# Altium project Calc_Project.PrjPcb
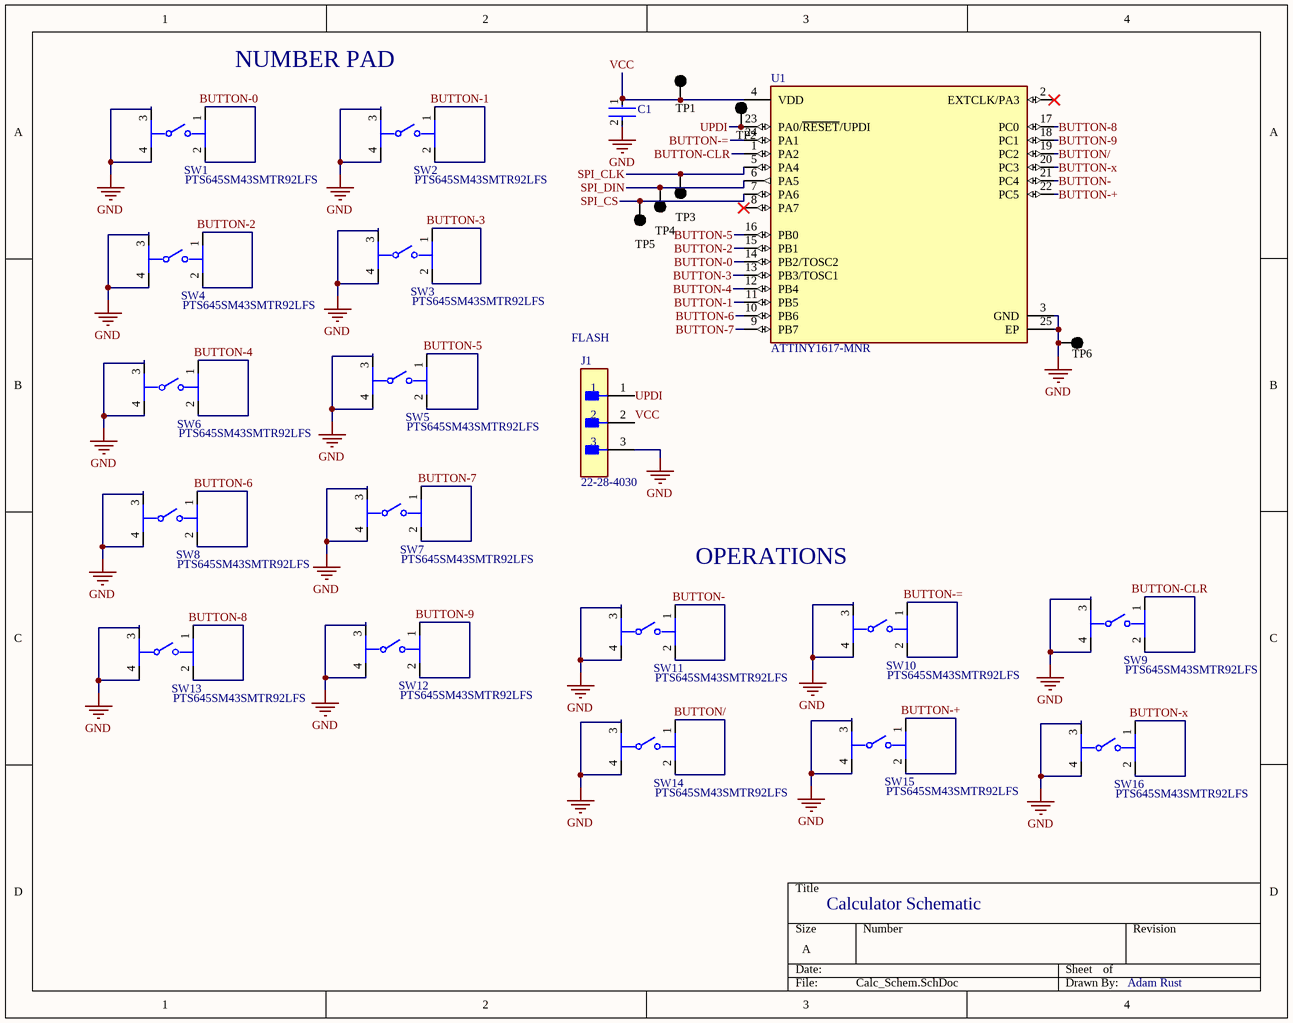
[diagram p0: Calc_Schem.SchDoc]
2 sheets, 35 parts. Net scope: global (net labels, ports and power ports of the same name join across sheets).
Board file: CalcPCB_Project.PcbDoc
Sheets:
  Calc_Schem.SchDoc
  MAX_7SEG_USBC.SchDoc

## Sheet Calc_Schem.SchDoc
size A; SheetNumber: 1; SheetTotal: 2

### Parts
C1  GRM155R71C104KA88D  [FP-GRM15-MFG]  (value not drawn)
J1  22-28-4030  [FP-22-28-4030-MFG]
SW1  PTS645SM43SMTR92LFS  [FP-PTS645SM43SMTR92LFS-MFG]
SW2  PTS645SM43SMTR92LFS  [FP-PTS645SM43SMTR92LFS-MFG]
SW3  PTS645SM43SMTR92LFS  [FP-PTS645SM43SMTR92LFS-MFG]
SW4  PTS645SM43SMTR92LFS  [FP-PTS645SM43SMTR92LFS-MFG]
SW5  PTS645SM43SMTR92LFS  [FP-PTS645SM43SMTR92LFS-MFG]
SW6  PTS645SM43SMTR92LFS  [FP-PTS645SM43SMTR92LFS-MFG]
SW7  PTS645SM43SMTR92LFS  [FP-PTS645SM43SMTR92LFS-MFG]
SW8  PTS645SM43SMTR92LFS  [FP-PTS645SM43SMTR92LFS-MFG]
SW9  PTS645SM43SMTR92LFS  [FP-PTS645SM43SMTR92LFS-MFG]
SW10  PTS645SM43SMTR92LFS  [FP-PTS645SM43SMTR92LFS-MFG]
SW11  PTS645SM43SMTR92LFS  [FP-PTS645SM43SMTR92LFS-MFG]
SW12  PTS645SM43SMTR92LFS  [FP-PTS645SM43SMTR92LFS-MFG]
SW13  PTS645SM43SMTR92LFS  [FP-PTS645SM43SMTR92LFS-MFG]
SW14  PTS645SM43SMTR92LFS  [FP-PTS645SM43SMTR92LFS-MFG]
SW15  PTS645SM43SMTR92LFS  [FP-PTS645SM43SMTR92LFS-MFG]
SW16  PTS645SM43SMTR92LFS  [FP-PTS645SM43SMTR92LFS-MFG]
TP1  BTN  [KSTN-5011_V]  (value not drawn)
TP2  BTN  [KSTN-5011_V]  (value not drawn)
TP3  BTN  [KSTN-5011_V]  (value not drawn)
TP4  BTN  [KSTN-5011_V]  (value not drawn)
TP5  BTN  [KSTN-5011_V]  (value not drawn)
TP6  BTN  [KSTN-5011_V]  (value not drawn)
U1  ATTINY1617-MNR  [FP-C04-21386-IPC_A]

### Nets
GND: C1.2 J1.3 SW1.3 SW1.4 SW2.3 SW2.4 SW3.3 SW3.4 SW4.3 SW4.4 SW5.3 SW5.4 SW6.3 SW6.4 SW7.3 SW7.4 SW8.3 SW8.4 SW9.3 SW9.4 SW10.3 SW10.4 SW11.3 SW11.4 SW12.3 SW12.4 SW13.3 SW13.4 SW14.3 SW14.4 SW15.3 SW15.4 SW16.3 SW16.4 TP6.1 U1.3(GND) U1.25(EP)
BUTTON-: SW11.1 SW11.2 U1.21(PC4)
BUTTON-0: SW1.1 SW1.2 U1.14(PB2/TOSC2)
BUTTON-1: SW2.1 SW2.2 U1.11(PB5)
BUTTON-2: SW4.1 SW4.2 U1.15(PB1)
BUTTON-3: SW3.1 SW3.2 U1.13(PB3/TOSC1)
BUTTON-4: SW6.1 SW6.2 U1.12(PB4)
BUTTON-5: SW5.1 SW5.2 U1.16(PB0)
BUTTON-6: SW8.1 SW8.2 U1.10(PB6)
BUTTON-7: SW7.1 SW7.2 U1.9(PB7)
BUTTON-8: SW13.1 SW13.2 U1.17(PC0)
BUTTON-9: SW12.1 SW12.2 U1.18(PC1)
BUTTON-+: SW15.1 SW15.2 U1.22(PC5)
BUTTON-=: SW10.1 SW10.2 U1.24(PA1)
BUTTON-CLR: SW9.1 SW9.2 U1.1(PA2)
BUTTON-x: SW16.1 SW16.2 U1.20(PC3)
BUTTON/: SW14.1 SW14.2 U1.19(PC2)
SPI_CLK: TP3.1 U1.5(PA4)
SPI_CS: TP5.1 U1.7(PA6)
SPI_DIN: TP4.1 U1.6(PA5)
UPDI: J1.1 TP2.1 U1.23(PA0/~{RESET}/UPDI)
VCC: C1.1 J1.2 TP1.1 U1.4(VDD)

Not connected (* = marked no-connect by the designer): U1 2(EXTCLK/PA3)* 8(PA7)*

### Notes on the sheet
- NUMBER PAD
- (near J1) FLASH
- OPERATIONS
- Calculator Schematic
- Adam Rust

### Library data of the parts
C1 = CMP-2100-03641-2: CAP CER 0.1UF 16V X7R 0402; Manufacturer: Murata; Standoff Height: 0mm; Tolerance: 10%; Voltage Rating: 16Vdc; Material: Ceramic; Capacitance: 0.10μF; Value: 0.10μF; RoHS: TRUE; Manufacturer Part Number: GRM155R71C104KA88D; Temperature Characteristic: X7R; Octopart: https://octopart.com/grm155r71c104ka88d-murata-196880; Digikey Description: CAP CER 0.1UF 16V X7R 0402; Device Class L3: Ceramic Capacitors; Height: 0.55mm; ComponentLink2Description: Datasheet; Temperature Range Low: -55°C; Ipc Land Pattern Name: CAPC10050X219; ComponentLink2URL: https://search.murata.co.jp/Ceramy/image/img/A01X/G101/ENG/GRM155R71H471KA01-01A.pdf; Device Class L1: Passive Components; Lead Free: yes; Category: Cap; Package: GRM15; Temperature: -55°C to +125°C; Device Class L2: Capacitors; Temperature Range High: +125°C; Mouser Description: 0402 0.1 uF 16V ±10 % Tolerance X7R SMT Multilayer Ceramic Capacitor
J1 = CMP-04776-000098-1: UPDI PROG; Manufacturer: Molex; Conn Orientation: Vertical; Conn Gender: Male; Current Rating: 4A; Pitch: 2.54mm; Voltage Rating: 500V; Number Of Contacts: 3; Category: Conn; Number Of Rows: 1; Manufacturer Part Number: 22-28-4030; RoHS: TRUE; Package: 22-28-4030; Footprint Url: https://www.molex.com/pdm_docs/sd/022284030_sd.pdf; ComponentLink2Description: Datasheet; Device Class L2: Headers and Wire Housings; Automotive: No; Temperature Range Low: -40°C; Digikey Description: CONN HEADER VERT 3POS 2.54MM; Mouser Description: Headers & Wire Housings 3P VERT HEADER Sn; Contact Material: Gold,Nickel; Device Class L1: Connectors; Lead Free: Yes; Device Class L3: unset; Temperature Range High: +80°C; Octopart: https://octopart.com/0022284030-molex-10476094; ComponentLink2URL: https://www.molex.com/webdocs/datasheets/pdf/en-us/0022284030_PCB_HEADERS.pdf; Height: 8.88mm; Temperature: -40°C to +80°C
SW1-SW16 = CMP-2000-05160-2: SWITCH TACTILE SPST-NO 0.05A 12V; Contact Resistance: 100mR; Throw Configuration: SPST; Illumination Type: Non-Illuminated; Mechanical Life: 100000Cycles; Current Rating: 50mA; Switch Function: Off-Mom; Actuator Length: 0.85mm; Actuator Material: Nylon; Actuator Type: Standard; Operating Force: 160gf; Min Operating Temperature: -20°C; REACH SVHC: No SVHC; Termination: Gull Wing; Case/Package: SMD/SMT; Packaging: Tape and Reel; Mount: Surface Mount; Voltage Rating (DC): 12V; Orientation: Straight; Lead Free: Lead Free; Contact Material: Silver; Color: Black; Max Current Rating: 50mA; Contact Plating: Silver; Depth: 9mm; Package Quantity: 1; Max Voltage Rating (DC): 12V; Length: 6mm; Max Operating Temperature: 60°C
TP1-TP6 = CMP-1672-00003-4: Test Point, Black, Through Hole, RoHS, Bulk; Manufacturer: Keystone; ComponentLink2URL: http://www.keyelco.com/product-pdf.cfm?p=1320; Colour: Black; Pins: 1; REACH SVHC: No SVHC; ComponentLink1URL: http://www.keyelco.com/; PackageReference: 5011; Contact Plating: Silver; Package Quantity: 100; Packaging: Bulk; RoHSCompliant: true; Height: 8.12 mm; PackageDescription: 1-Pin Through Hole Device, Dia 3.17 mm; Mount: Through Hole; Mounting Technology: Through Hole; DatasheetVersion: Rev. F, 12/2013; ComponentLink1Description: Manufacturer URL; Contact Material: Bronze; ComponentLink2Description: Datasheet
U1 = CMP-06276-000207-1: IC MCU 8BIT 16KB FLASH 24VQFN; Frequency: 20MHz; Core Architecture: AVR; Number of I/Os: 22; Oscillator Type: Internal; Interface: I2C; Peripherals: Brown-out Detect/Reset; Memory Type: FLASH; Packaging: Tape and Reel; Memory Size: 16KB; RoHS Compliant: Yes; Max Operating Temperature: 105°C; Case/Package: VQFN; Min Operating Temperature: -40°C

## Sheet MAX_7SEG_USBC.SchDoc
size A; SheetNumber: 2; SheetTotal: 2
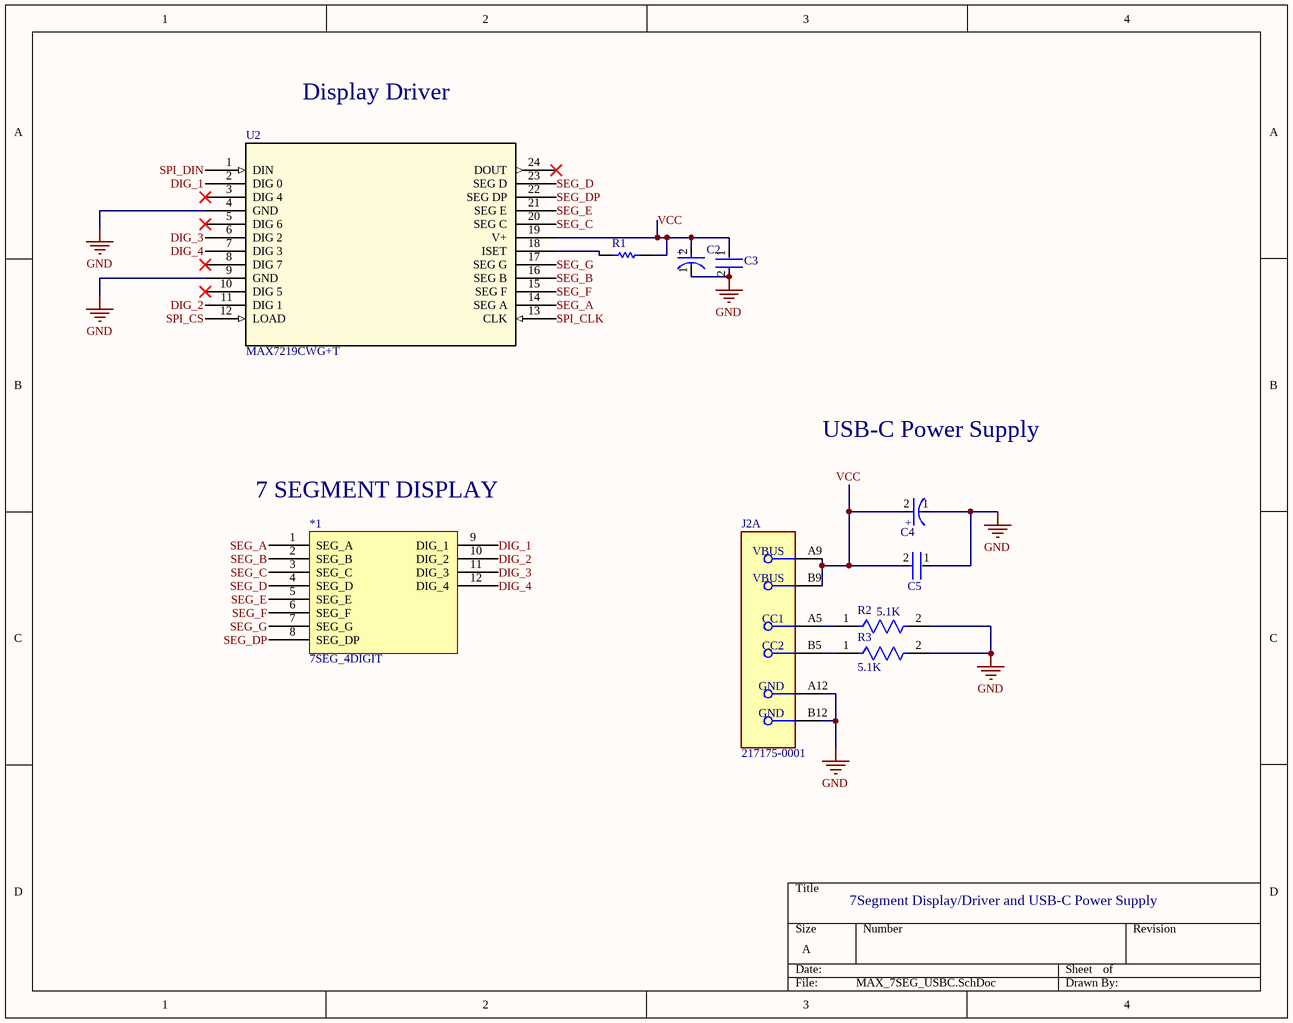
[diagram p1: MAX_7SEG_USBC.SchDoc]

### Parts
*1  7SEG_4DIGIT  [PCBComponent_1]
C2  TAJB106K010RNJ  [FP-TAJB-MFG]  (value not drawn)
C3  GRM155R71C104KA88D  [FP-GRM15-MFG]  (value not drawn)
C4  TAJB106K010RNJ  [FP-TAJB-MFG]  (value not drawn)
C5  GRM155R71C104KA88D  [FP-GRM15-MFG]  (value not drawn)
J2  217175-0001  [FP-217175-0001-MFG]  (part A of 2)
R1  RC0402FR-0710KL  [RESC1005X40X25LL05T10]  (value not drawn)
R2  5.1K  [FP-RN73R1E-IPC_C]
R3  5.1K  [FP-RN73R1E-IPC_C]
U2  MAX7219CWG+T  [21-0042B_24_MXM]

### Nets
GND: C2.1(C) C3.2 C4.1(C) C5.1 J2.A12(GND) J2.B12(GND) R2.2 R3.2 U2.4(GND) U2.9(GND)
DIG_1: *1.9(DIG_1) U2.2(DIG_0)
DIG_2: *1.10(DIG_2) U2.11(DIG_1)
DIG_3: *1.11(DIG_3) U2.6(DIG_2)
DIG_4: *1.12(DIG_4) U2.7(DIG_3)
SEG_A: *1.1(SEG_A) U2.14(SEG_A)
SEG_B: *1.2(SEG_B) U2.16(SEG_B)
SEG_C: *1.3(SEG_C) U2.20(SEG_C)
SEG_D: *1.4(SEG_D) U2.23(SEG_D)
SEG_DP: *1.8(SEG_DP) U2.22(SEG_DP)
SEG_E: *1.5(SEG_E) U2.21(SEG_E)
SEG_F: *1.6(SEG_F) U2.15(SEG_F)
SEG_G: *1.7(SEG_G) U2.17(SEG_G)
SPI_CLK: U2.13(CLK)
SPI_CS: U2.12(LOAD)
SPI_DIN: U2.1(DIN)
VCC: C2.2(A) C3.1 C4.2(A) C5.2 J2.A9(VBUS) J2.B9(VBUS) R1.2 U2.19(V+)
NetJ2_A5: J2.A5(CC1) R2.1
NetJ2_B5: J2.B5(CC2) R3.1
NetR1_1: R1.1 U2.18(ISET)

Not connected (* = marked no-connect by the designer): U2 3(DIG_4)* 5(DIG_6)* 8(DIG_7)* 10(DIG_5)* 24(DOUT)*

### Notes on the sheet
- Display Driver
- (near *1) 7 SEGMENT DISPLAY
- USB-C Power Supply
- 7Segment Display/Driver and USB-C Power Supply
- (in symbol CMP-04424-000573-1) +

### Library data of the parts
*1 = 7SEG_4DIGIT: 4 Digit 7 Segment Common Cathode Display
C2 C4 = CMP-04424-000573-1: 10uF 10V  ±10% 2.1Ω 1210  SMD Tantalum Capacitor; ESR (Equivalent Series Resistance): 2.5R; Q Factor: 6; Dissipation Factor: 6%; Leakage Current: 1uA; Polarity: Polar; RoHS Compliant: Yes; Mount: Surface Mount; Capacitance: 10uF; Voltage Rating: 10V; Width: 2.8mm; Dielectric Material: Tantalum; Tolerance: 10%; Case/Package: 1210; Termination: SMD/SMT; Length: 3.5mm; REACH SVHC: No SVHC; Packaging: Tape and Reel; Radiation Hardening: No; Lead Free: Lead Free; Min Operating Temperature: -55°C; Package Quantity: 2000; Series: TAJ; Voltage Rating (DC): 10V; Features: General Purpose; Height: 1.9mm; Height - Seated (Max): 0.083inch; Depth: 2.8mm; Case Code (Imperial): 1210; Case Code (Metric): 3528; Voltage: 10V; Max Operating Temperature: 125°C
C3 C5 = CMP-2100-03641-2: as C1 on sheet Calc_Schem; RoHS: TRUE; Manufacturer Part Number: GRM155R71C104KA88D; Temperature Characteristic: X7R; Octopart: https://octopart.com/grm155r71c104ka88d-murata-196880; Digikey Description: CAP CER 0.1UF 16V X7R 0402; Device Class L3: Ceramic Capacitors; Height: 0.55mm; ComponentLink2Description: Datasheet; Temperature Range Low: -55°C; Ipc Land Pattern Name: CAPC10050X219; ComponentLink2URL: https://search.murata.co.jp/Ceramy/image/img/A01X/G101/ENG/GRM155R71H471KA01-01A.pdf; Device Class L1: Passive Components; Lead Free: yes; Category: Cap; Package: GRM15; Temperature: -55°C to +125°C; Device Class L2: Capacitors; Temperature Range High: +125°C; Mouser Description: 0402 0.1 uF 16V ±10 % Tolerance X7R SMT Multilayer Ceramic Capacitor
J2 = CMP-04767-000026-1: CONN RCP USB2.0 C 6+18P SMD RA
R1 = CMP-2002-07353-1: Manufacturer: Yageo / Phycomp; Part Number: RC0402FR-0710KL
R2 R3 = CMP-04015-008529-1: 5.1kΩ ±1% 0.063W, 1/16W Chip Resistor 0402 (1005 Metric) Moisture Resistant Thin Film
U2 = MAX7219CWG+T: Serially Interfaced, 8-Digit, LED Display Drivers; Manufacturer_Name: Analog Devices Inc; Copyright: Copyright (C) 2026 Ultra Librarian. All rights reserved.; Manufacturer_Part_Number: MAX7219CWG+T; RefDes: RefDes; Type: Type

## Nets that join several sheets
GND: Calc_Schem (37 pins), MAX_7SEG_USBC (10 pins)
SPI_CLK: Calc_Schem (TP3.1 U1.5), MAX_7SEG_USBC (U2.13)
SPI_CS: Calc_Schem (TP5.1 U1.7), MAX_7SEG_USBC (U2.12)
SPI_DIN: Calc_Schem (TP4.1 U1.6), MAX_7SEG_USBC (U2.1)
VCC: Calc_Schem (C1.1 J1.2 TP1.1 U1.4), MAX_7SEG_USBC (8 pins)